# EAGLE design OptoRelayX2 (EAGLE 8.7.1)
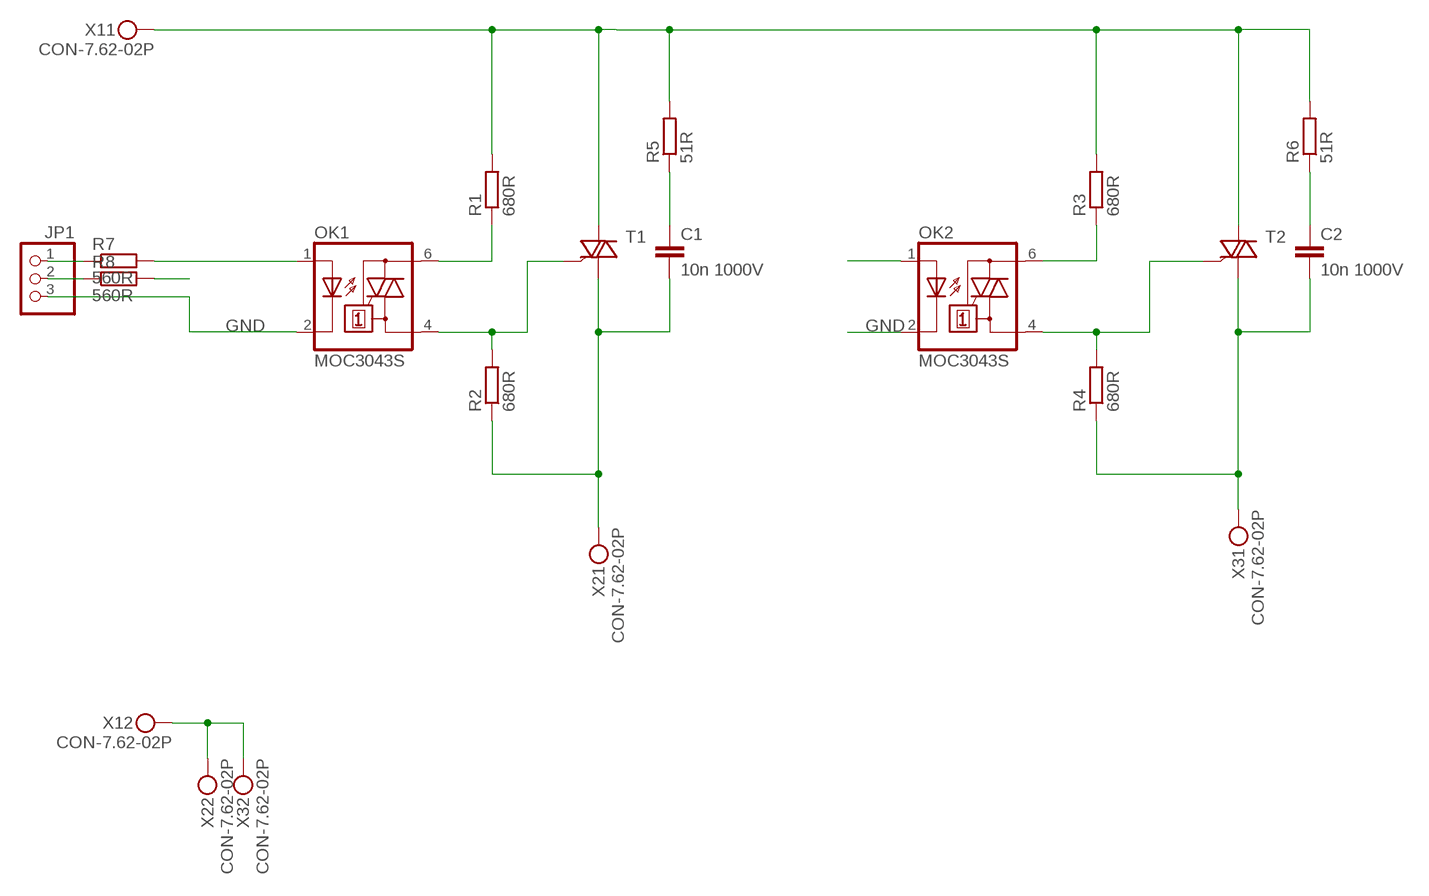
[diagram p0: schematic, sheet 1]

## Parts
C1  10n 1000V  CAP_C50-024X044  [C050-024X044]
C2  10n 1000V  CAP_C50-024X044  [C050-024X044]
JP1  PINHD-1X3  [1X03]
OK1  MOC3043S  [DIL6-SMD]
OK2  MOC3043S  [DIL6-SMD]
R1  680R  R_MF-05  [MF-05]
R2  680R  R_MF-05  [MF-05]
R3  680R  R_MF-05  [MF-05]
R4  680R  R_MF-05  [MF-05]
R5  51R  R_MF-2  [MF-2]
R6  51R  R_MF-2  [MF-2]
R7  560R  R_0805  [R0805]
R8  560R  R_0805  [R0805]
T1  TRIAC  [DPAK]
T2  TRIAC  [DPAK]
X1  CON-7.62-02P  [KF25C-7.62-02P-13]
X2  CON-7.62-02P  [KF25C-7.62-02P-13]
X3  CON-7.62-02P  [KF25C-7.62-02P-13]

## Nets
GND: JP1.3 OK1.2(C) OK2.2(C)
N$1: X1.P$2 X2.P$2 X3.P$2
N$2: R1.2 R3.2 R5.2 R6.2 T1.D(A2) T2.D(A2) X1.P$1
N$3: C1.1 R5.1
N$4: OK1.6(A2) R1.1
N$5: OK2.6(A2) R3.1
N$6: OK2.4(A1) R4.2 T2.S(G)
N$7: OK1.4(A1) R2.2 T1.S(G)
N$8: C1.2 R2.1 T1.G(A1) X2.P$1
N$9: C2.2 R4.1 T2.G(A1) X3.P$1
N$10: C2.1 R6.1
N$11: JP1.1 R7.1
N$12: JP1.2 R8.1
N$13: OK1.1(A) R7.2
N$14: OK2.1(A) R8.2

## Library data of the parts
C1 C2 = Flamberm:CAP_
JP1 = pinhead:PINHD-1X3: PIN HEADER
OK1 OK2 = optocoupler:MOC30*: 6-Pin DIP Zero-Cross Optoisolators Triac Driver Output (250/400 Volt Peak) Source: Data sheet <http://www.fairchildsemi.com/ds/MO/MOC3031M.pdf> The old path of data sheet not more available 2013-05-06.; MF: FAIRCHILD SEMICONDUCTOR; MPN: MOC3043SM; OC_FARNELL: 1505441; OC_NEWARK: 78K6091
R1-R8 = Flamberm:R_
T1 T2 = Flamberm:TRIAC
X1-X3 = Flamberm:CON-7.62-02P

## Board
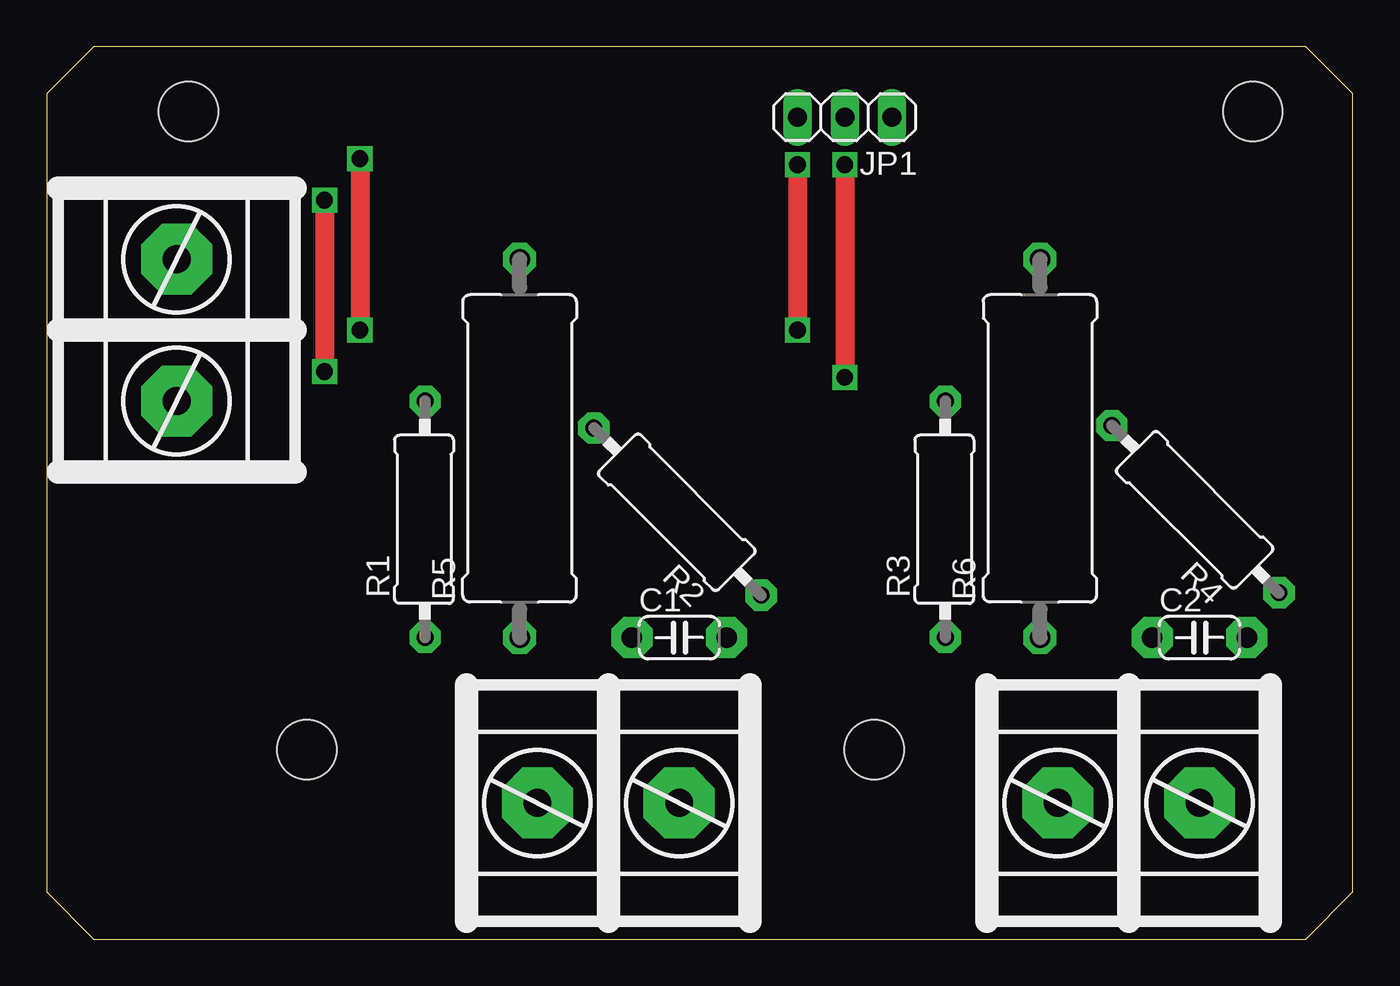
[diagram p1: board, top side]
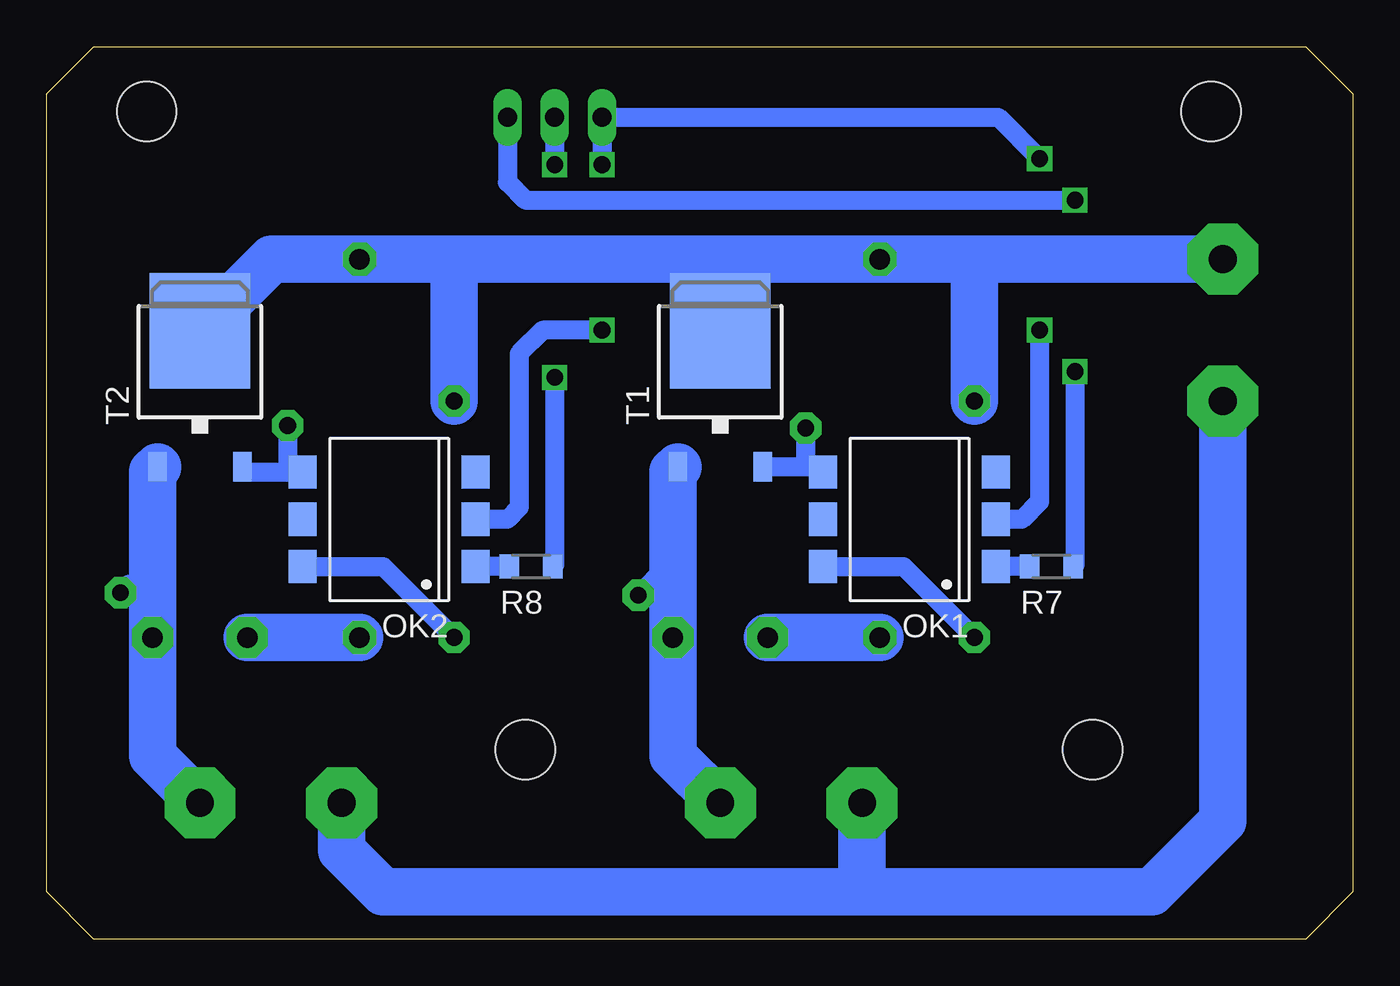
[diagram p2: board, bottom side, seen from below]

Size 70.15 x 47.93 mm. Coordinates in mm from the lower left corner, seen from the top.
Outline: 0,45.39 0,2.54 2.54,0 67.61,0 70.15,2.54 70.15,45.39 67.61,47.93 2.54,47.93 0,45.39
Copper layers (1*16): Top 0.035mm / dielectric 1.5mm / Bottom 0.035mm
Design rules "default": minimum track width 6mil, minimum drill 0.35mm, track to track 6mil, track to pad 6mil, pad to pad 6mil, via to via 6mil, smd to smd 6mil, copper to edge 40mil, drill to drill 6mil, minimum pad ring 10mil, minimum via ring 8mil, stop-mask expansion 4mil, vias tented up to drill 0mil, thermal gap 10mil
Holes 3.2 mm at 13.97,10.16 44.45,10.16 64.77,44.45 7.62,44.45

### Footprints (pad centres in the part's own frame; a part is rotated, then mirrored left to right if it is on the bottom)
C050-024X044 = drill 1.1 pad 2.184 octagon: 1 -2.54,0; 2 2.54,0
1X03 = drill 1.016 long: 1 -2.54,0; 2 0,0; 3 2.54,0
DIL6-SMD = smd 1.78 x 1.52: 1 -2.54,-4.645; 2 0,-4.645; 3 2.54,-4.645; 4 2.54,4.645; 5 0,4.645; 6 -2.54,4.645
MF-05 = drill 0.9 pad 1.676 octagon: 1 -6.35,0; 2 6.35,0
MF-2 = drill 1.1 pad 1.778 octagon: 1 -10.16,0; 2 10.16,0
R0805 = smd 1.05 x 1.3: 1 -1.175,0; 2 1.175,0
DPAK = smd 5.4 x 6.2: D 0,2.5 | smd 1 x 1.6: G -2.28,-4.8; S 2.28,-4.8
KF25C-7.62-02P-13 = drill 1.5 pad 3.81 octagon: P$1 -3.81,0; P$2 3.81,0

### Placement (x,y rotation side)
C1  33.97,16.19 0 top
C2  61.91,16.19 0 top
JP1  42.86,44.13 180 top
OK1  23.81,22.54 90 bottom
OK2  51.75,22.54 90 bottom
R1  20.32,22.54 90 top
R2  33.88,22.95 135 top
R3  48.26,22.54 90 top
R4  61.69,23.08 135 top
R5  25.4,26.35 90 top
R6  53.34,26.35 90 top
R7  16.19,20 180 bottom
R8  44.13,20 180 bottom
T1  33.97,30.16 0 bottom
T2  61.91,30.16 0 bottom
X1  6.99,32.7 270 top
X2  30.16,7.3 180 top
X3  58.1,7.3 180 top

### Tracks (layer width: path | path; a pad name or v marks a point on that pad's centre or on a via)
GND  (via drill 0.9)
  Top 1.016: v40.32,41.59 v40.32,32.7 | v16.83,41.91 v16.83,32.7
  Bottom 1.016: v40.32,41.59 JP1.3 19.05,44.13 v16.83,41.91 | v40.32,32.7 43.5,32.7 44.77,31.43 44.77,23.18 45.4,22.54 OK2.2 | v16.83,32.7 16.83,23.5 17.78,22.54 OK1.2
N$1
  Bottom 2.54: X3.P$2 54.29,4.76 52.07,2.54 26.35,2.54 | 26.35,2.54 22.86,2.54 10.79,2.54 6.99,6.35 X1.P$2 | X2.P$2 26.35,2.54
N$2
  Bottom 2.54: X1.P$1 20.32,36.51 | 20.32,36.51 R5.2 33.97,36.51 | 33.97,36.51 48.26,36.51 | 48.26,36.51 R6.2 58.06,36.51 T2.D | 33.97,36.51 T1.D | R1.2 20.32,36.51 | R3.2 48.26,36.51
N$3
  Bottom 2.54: C1.1 R5.1
N$4
  Bottom 1.016: OK1.6 24.13,20 R1.1
N$5
  Bottom 1.016: OK2.6 52.07,20 R3.1
N$6
  Bottom 1.016: T2.S 59.35,25.08 57.15,25.08 | 57.15,25.08 OK2.4 | R4.2 57.2,25.13 57.15,25.08
N$7
  Bottom 1.016: OK1.4 28.74,25.36 29.21,25.36 | 29.21,25.36 T1.S | R2.2 29.39,25.54 29.21,25.36
N$8
  Bottom 1.016: 36.79,25.36 T1.G | R2.1 36.83,20 36.51,20
  Bottom 2.54: T1.G 36.51,25.1 36.51,20 C1.2 36.51,9.84 X2.P$1
N$9
  Bottom 1.016: 64.73,25.36 T2.G | R4.1 65.72,19.05 64.45,19.05
  Bottom 2.54: T2.G 64.45,25.1 64.45,19.05 C2.2 64.45,9.84 X3.P$1
N$10
  Bottom 2.54: R6.1 C2.1
N$11  (via drill 0.9)
  Top 1.016: v14.92,39.69 v14.92,30.48
  Bottom 1.016: JP1.1 45.4,40.64 44.45,39.69 v14.92,39.69 | v14.92,30.48 14.92,20.1 R7.1
N$12  (via drill 0.9)
  Top 1.016: v42.86,41.59 v42.86,30.16
  Bottom 1.016: JP1.2 v42.86,41.59 | v42.86,30.16 42.86,20.1 R8.1
N$13
  Bottom 1.016: R7.2 OK1.1
N$14
  Bottom 1.016: R8.2 OK2.1